# Altium project 8 IR.PrjPcb
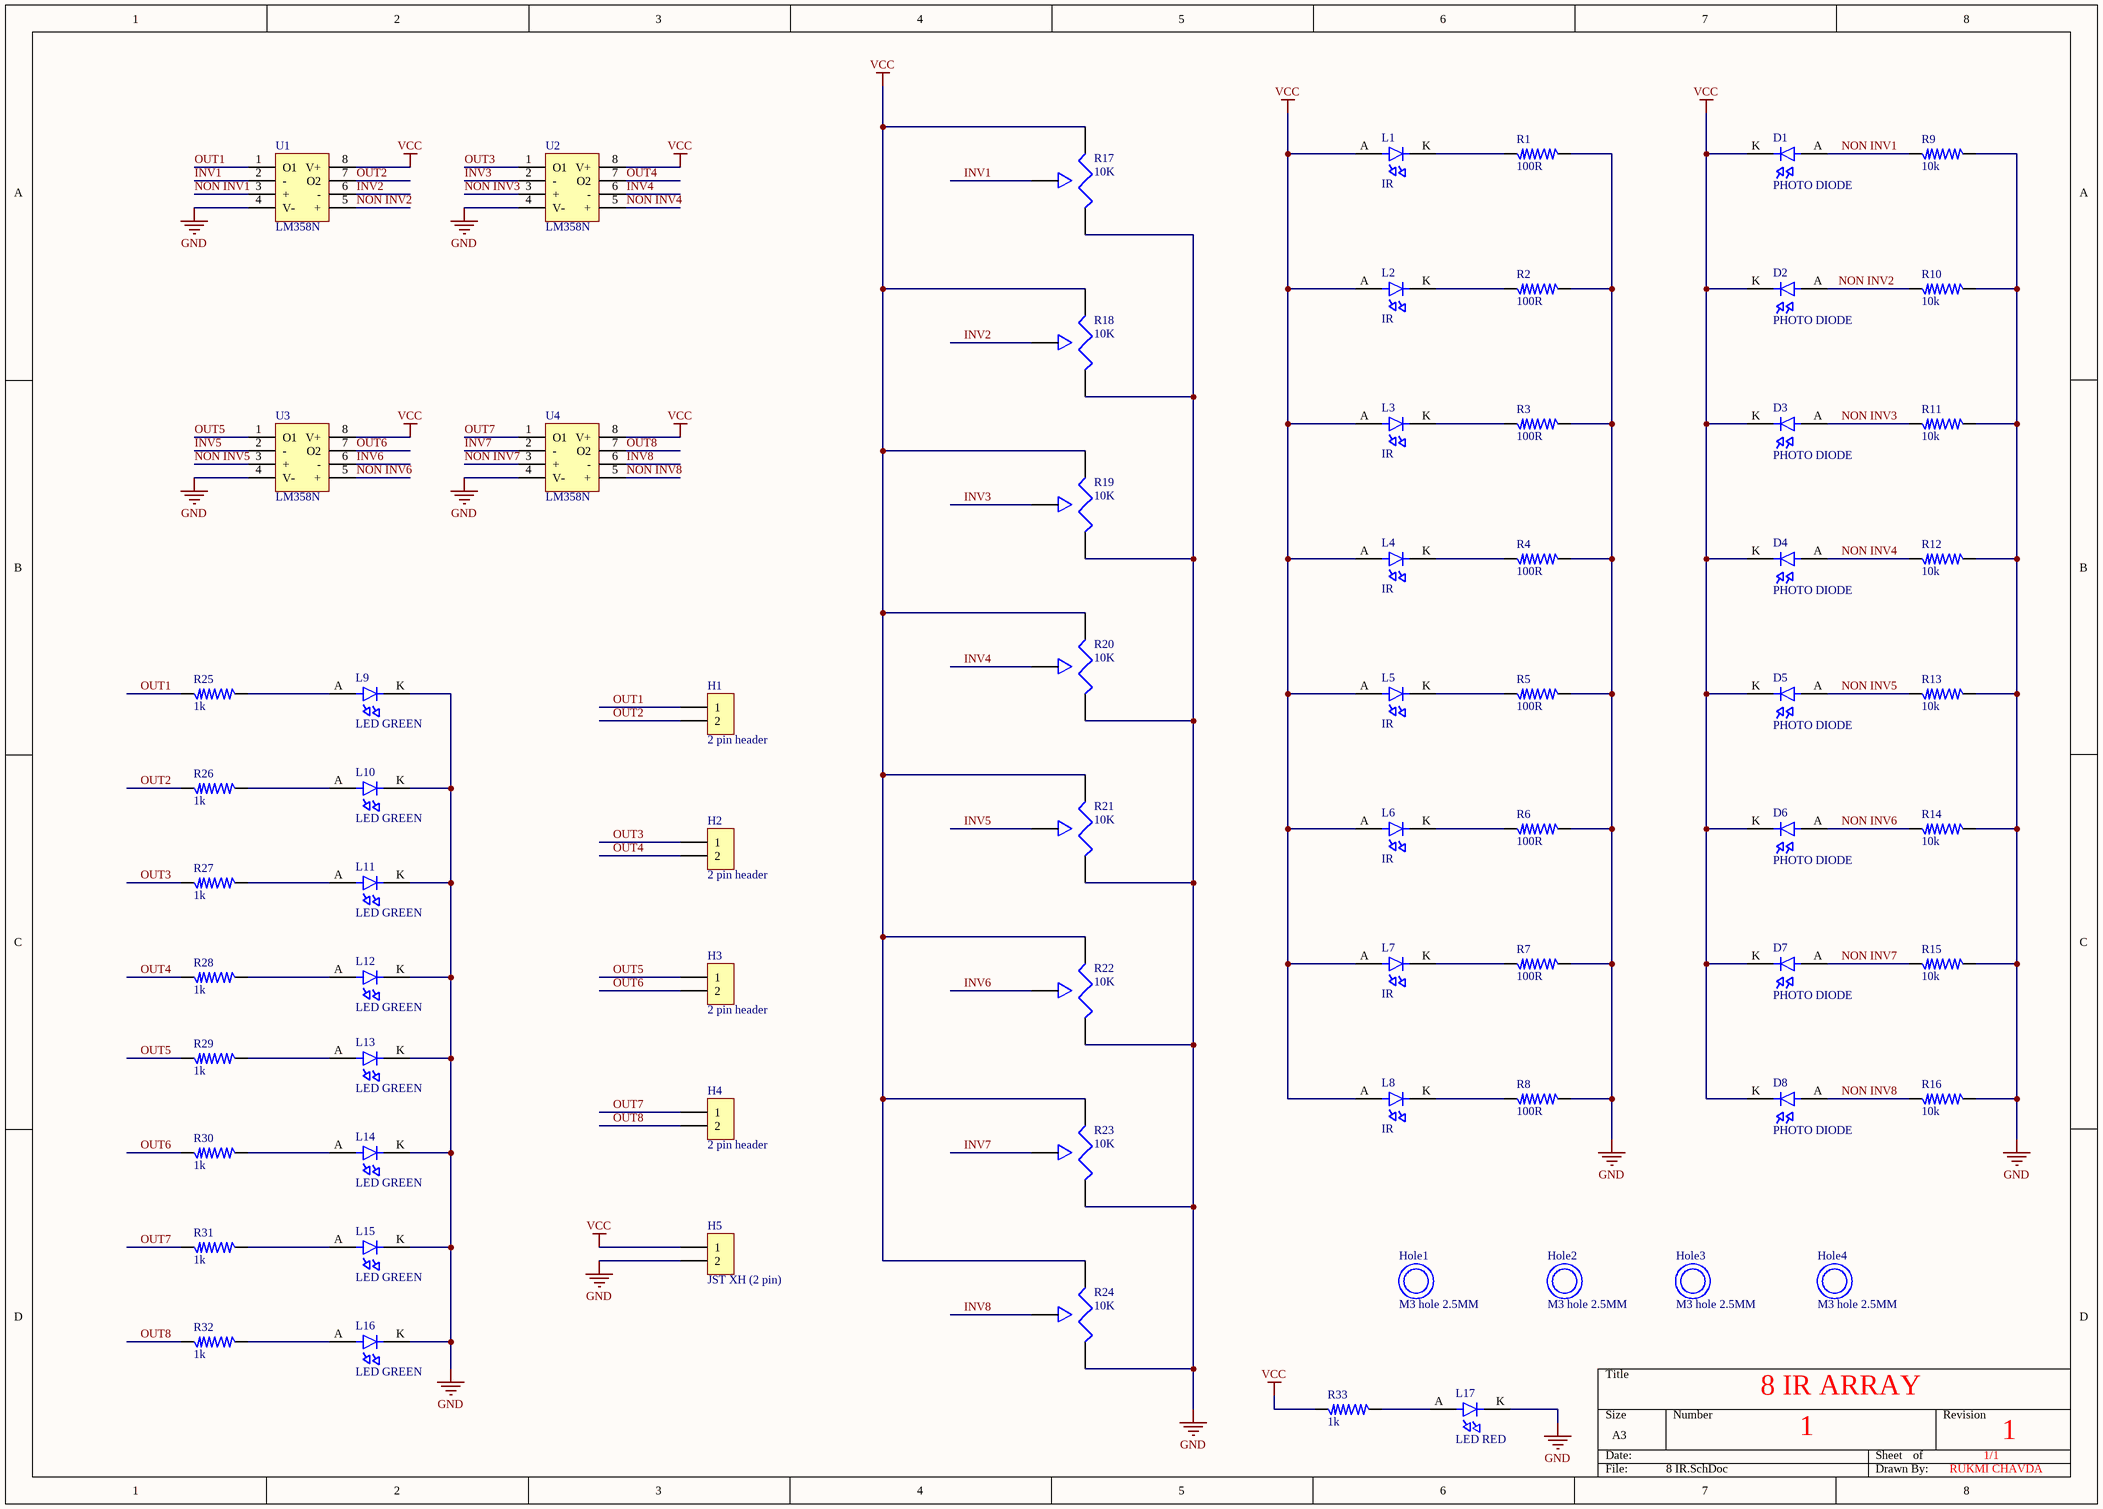
[diagram p0: 8 IR.SchDoc]
1 sheet, 71 parts. Net scope: global (net labels, ports and power ports of the same name join across sheets).
Board file: 8 IR.PcbDoc

## Sheet 8 IR.SchDoc
size A3

### Parts
D1  PHOTO DIODE  [PHOYODIODE]
D2  PHOTO DIODE  [PHOYODIODE]
D3  PHOTO DIODE  [PHOYODIODE]
D4  PHOTO DIODE  [PHOYODIODE]
D5  PHOTO DIODE  [PHOYODIODE]
D6  PHOTO DIODE  [PHOYODIODE]
D7  PHOTO DIODE  [PHOYODIODE]
D8  PHOTO DIODE  [PHOYODIODE]
H1  2 pin header  [header 2]
H2  2 pin header  [header 2]
H3  2 pin header  [header 2]
H4  2 pin header  [header 2]
H5  JST XH (2 pin)  [jst 2 pin XH]
Hole1  M3 hole 2.5MM  [M3 Hole]  (no BOM)
Hole2  M3 hole 2.5MM  [M3 Hole]  (no BOM)
Hole3  M3 hole 2.5MM  [M3 Hole]  (no BOM)
Hole4  M3 hole 2.5MM  [M3 Hole]  (no BOM)
L1  IR  [LED IR]
L2  IR  [LED IR]
L3  IR  [LED IR]
L4  IR  [LED IR]
L5  IR  [LED IR]
L6  IR  [LED IR]
L7  IR  [LED IR]
L8  IR  [LED IR]
L9  LED GREEN  [LED GREEN]
L10  LED GREEN  [LED GREEN]
L11  LED GREEN  [LED GREEN]
L12  LED GREEN  [LED GREEN]
L13  LED GREEN  [LED GREEN]
L14  LED GREEN  [LED GREEN]
L15  LED GREEN  [LED GREEN]
L16  LED GREEN  [LED GREEN]
L17  LED RED  [LED RED]
R1  100R  [100R]
R2  100R  [100R]
R3  100R  [100R]
R4  100R  [100R]
R5  100R  [100R]
R6  100R  [100R]
R7  100R  [100R]
R8  100R  [100R]
R9  10k  [10k]
R10  10k  [10k]
R11  10k  [10k]
R12  10k  [10k]
R13  10k  [10k]
R14  10k  [10k]
R15  10k  [10k]
R16  10k  [10k]
R17  10K  [trimer pot]
R18  10K  [trimer pot]
R19  10K  [trimer pot]
R20  10K  [trimer pot]
R21  10K  [trimer pot]
R22  10K  [trimer pot]
R23  10K  [trimer pot]
R24  10K  [trimer pot]
R25  1k  [1k]
R26  1k  [1k]
R27  1k  [1k]
R28  1k  [1k]
R29  1k  [1k]
R30  1k  [1k]
R31  1k  [1k]
R32  1k  [1k]
R33  1k  [1k]
U1  LM358N  [LM 358 DIP]
U2  LM358N  [LM 358 DIP]
U3  LM358N  [LM 358 DIP]
U4  LM358N  [LM 358 DIP]

### Nets
GND: H5.2 L9.K L10.K L11.K L12.K L13.K L14.K L15.K L16.K L17.K R1.2 R2.2 R3.2 R4.2 R5.2 R6.2 R7.2 R8.2 R9.2 R10.2 R11.2 R12.2 R13.2 R14.2 R15.2 R16.2 R17.1 R18.1 R19.1 R20.1 R21.1 R22.1 R23.1 R24.1 U1.4(V-) U2.4(V-) U3.4(V-) U4.4(V-)
VCC: D1.K D2.K D3.K D4.K D5.K D6.K D7.K D8.K H5.1 L1.A L2.A L3.A L4.A L5.A L6.A L7.A L8.A R17.2 R18.2 R19.2 R20.2 R21.2 R22.2 R23.2 R24.2 R33.1 U1.8(V+) U2.8(V+) U3.8(V+) U4.8(V+)
INV1: R17.3 U1.2(-)
INV2: R18.3 U1.6(-)
INV3: R19.3 U2.2(-)
INV4: R20.3 U2.6(-)
INV5: R21.3 U3.2(-)
INV6: R22.3 U3.6(-)
INV7: R23.3 U4.2(-)
INV8: R24.3 U4.6(-)
NON INV1: D1.A R9.1 U1.3(+)
NON INV2: D2.A R10.1 U1.5(+)
NON INV3: D3.A R11.1 U2.3(+)
NON INV4: D4.A R12.1 U2.5(+)
NON INV5: D5.A R13.1 U3.3(+)
NON INV6: D6.A R14.1 U3.5(+)
NON INV7: D7.A R15.1 U4.3(+)
NON INV8: D8.A R16.1 U4.5(+)
OUT1: H1.1 R25.1 U1.1(O1)
OUT2: H1.2 R26.1 U1.7(O2)
OUT3: H2.1 R27.1 U2.1(O1)
OUT4: H2.2 R28.1 U2.7(O2)
OUT5: H3.1 R29.1 U3.1(O1)
OUT6: H3.2 R30.1 U3.7(O2)
OUT7: H4.1 R31.1 U4.1(O1)
OUT8: H4.2 R32.1 U4.7(O2)
NetL1_K: L1.K R1.1
NetL2_K: L2.K R2.1
NetL3_K: L3.K R3.1
NetL4_K: L4.K R4.1
NetL5_K: L5.K R5.1
NetL6_K: L6.K R6.1
NetL7_K: L7.K R7.1
NetL8_K: L8.K R8.1
NetL9_A: L9.A R25.2
NetL10_A: L10.A R26.2
NetL11_A: L11.A R27.2
NetL12_A: L12.A R28.2
NetL13_A: L13.A R29.2
NetL14_A: L14.A R30.2
NetL15_A: L15.A R31.2
NetL16_A: L16.A R32.2
NetL17_A: L17.A R33.2

### Notes on the sheet
- 8 IR ARRAY
- 1
- 1/1
- RUKMI CHAVDA

### Library data of the parts
D1-D8 = PHOTO DIODE: VISHAY         BPW24R             PHOTODIODE, 11PF; Manufacturer 1: Vishay Semiconductors; Max Reverse Voltage (DC): 60V; Fall Time: 7ns; Max Power Dissipation: 210mW; Diode Type: PIN; Dark Current: 2nA; Wavelength: 900nm; Viewing Angle: 24°; Breakdown Voltage: 200V; Supplier 1: Digi-Key; Manufacturer Part Number 1: BPW24R; RoHS: Yes; Category: Photodiodes; Stock 1: 330; Pricing 1: 1=4.50000, 10=3.75000, 100=2.62500, 500=2.17500, 1000=1.99500, 2500=1.91250, 5000=1.87500, 10000=1.83750, 25000=1.83000 (USD); Mount: Through Hole,PCB; Case/Package: TO-18; Number of Pins: 2; Min Operating Temperature: -40°C; Max Operating Temperature: 125°C; Packaging: Bulk; Package Quantity: 1000; Reverse Voltage (DC): 60V; Power Dissipation: 210mW; Rise Time: 7ns; Reverse Breakdown Voltage: 60V; Length: 5.5mm; Height: 6.15mm; Width: 5.5mm; Radiation Hardening: No; REACH SVHC: Unknown; Lead Free: Lead Free; ComponentLink1URL: https://datasheet.ciiva.com/1249/bpw24r-1249072.pdf?src-supplier=Element14; ComponentLink1Description: https://datasheet.ciiva.com/1249/bpw24r-1249072.pdf?src-supplier=Element14; ComponentLink2URL: https://datasheet.ciiva.com/25620/0900766b80e22c13-25620417.pdf?src-supplier=RSComponents; ComponentLink2Description: https://datasheet.ciiva.com/25620/0900766b80e22c13-25620417.pdf?src-supplier=RSComponents; ComponentLink3URL: https://datasheet.ciiva.com/12069/bpw24r-84710-12069380.pdf?src-supplier=Mouser; ComponentLink3Description: https://datasheet.ciiva.com/12069/bpw24r-84710-12069380.pdf?src-supplier=Mouser; ComponentLink4URL: https://datasheet.ciiva.com/15117/getdatasheetpartid-513681-15117156.pdf?src-supplier=Verical; ComponentLink4Description: https://datasheet.ciiva.com/15117/getdatasheetpartid-513681-15117156.pdf?src-supplier=Verical; ComponentLink5URL: https://datasheet.ciiva.com/4269/bpw24r-4269996.pdf?src-supplier=Arrow+Electronics; ComponentLink5Description: https://datasheet.ciiva.com/4269/bpw24r-4269996.pdf?src-supplier=Arrow+Electronics; ComponentLink6URL: https://datasheet.ciiva.com/2819/bpw24r-2819745.pdf?src-supplier=Digi-Key; ComponentLink6Description: https://datasheet.ciiva.com/2819/bpw24r-2819745.pdf?src-supplier=Digi-Key; ComponentLink7URL: https://datasheet.ciiva.com/14098/bpw24r-eng-tds-14098567.pdf?src-supplier=Distrelec; ComponentLink7Description: https://datasheet.ciiva.com/14098/bpw24r-eng-tds-14098567.pdf?src-supplier=Distrelec; ComponentLink8URL: https://datasheet.ciiva.com/16349/bpw24r-16349740.pdf?src-supplier=Future+Electronics; ComponentLink8Description: https://datasheet.ciiva.com/16349/bpw24r-16349740.pdf?src-supplier=Future+Electronics; Supplier Part Number 1: 751-1014-ND
H1-H4 = 2 pin header: connector
H5 = JST XH (2 pin): Conn Shrouded Header (4 Sides) HDR 2 POS 2.5mm Solder ST Thru-Hole Box; Manufacturer Part Number: B2B-XH-A(LF)(SN); Number of Positions: 2; Connector Type: Male Pin; Contact Resistance: 20mR; Max Current Rating: 3A; Max Voltage Rating (AC): 250V; Insulation Resistance: 1GR; Wire/Cable Gauge: 22AWG; Supplier 1: Newark; Manufacturer: JST; RoHS: Yes; Category: FFC / FPC; Stock 1: 263047; Pricing 1: 1=0.26000, 10=0.22300, 100=0.19700, 500=0.17500, 1000=0.17100, 5000=0.15500, 10000=0.14500 (USD); Mount: Through Hole; Contact Plating: Tin,Copper,Lead; Color: Natural; Contact Material: Brass; Housing Color: White; Housing Material: Polyamide; Min Operating Temperature: -25°C; Max Operating Temperature: 85°C; Number of Rows: 1; Packaging: Bulk; Termination: Solder; Fastening Type: Detent; Orientation: Straight; Current Rating: 3A; Voltage Rating: 250V; Voltage Rating (AC): 250V; Number of Contacts: 2; Max Voltage Rating (DC): 250V; Length: 7.4mm; Pitch: 2.5mm; Depth: 5.75mm; Lead Pitch: 2.5mm; Lead Free: Lead Free; REACH SVHC: No SVHC; ComponentLink1URL: https://datasheet.ciiva.com/26894/getdatasheetpartid-640357-26894434.pdf?src-supplier=Verical; ComponentLink1Description: https://datasheet.ciiva.com/26894/getdatasheetpartid-640357-26894434.pdf?src-supplier=Verical; ComponentLink2URL: https://datasheet.ciiva.com/11746/0900766b8082653e-11746979.pdf?src-supplier=RSComponents; ComponentLink2Description: https://datasheet.ciiva.com/11746/0900766b8082653e-11746979.pdf?src-supplier=RSComponents; ComponentLink3URL: https://datasheet.ciiva.com/26894/getdatasheetpartid-385291-26894760.pdf?src-supplier=Verical; ComponentLink3Description: https://datasheet.ciiva.com/26894/getdatasheetpartid-385291-26894760.pdf?src-supplier=Verical; ComponentLink4URL: https://datasheet.ciiva.com/8052/5448-8052024.pdf?src-supplier=Element14; ComponentLink4Description: https://datasheet.ciiva.com/8052/5448-8052024.pdf?src-supplier=Element14; ComponentLink5URL: https://datasheet.ciiva.com/20207/523653-20207167.pdf?src-supplier=Rapid+Electronics; ComponentLink5Description: https://datasheet.ciiva.com/20207/523653-20207167.pdf?src-supplier=Rapid+Electronics; Supplier Part Number 1: 73M9415
Hole1-Hole4 = M3 hole 2.5MM: Mounting hole
L1-L8 = IR: EMITTER IR 940NM 100MA RADIAL; Manufacturer 1: Everlight; Manufacturer Part Number 1: IR333-A; Test Current: 20mA; Forward Voltage: 1.2V; Viewing Angle: 20°; Lens Style: Diffused,Colored,Circular; Number of Elements: 1; Forward Current: 50mA; Max Power Dissipation: 100mW; Reverse Voltage: 5V; Supplier 1: Digi-Key; RoHS: Yes; Category: LEDs; Stock 1: 103626; Pricing 1: 1=0.44000, 10=0.31500, 100=0.14000, 500=0.09800, 1000=0.08050, 2500=0.07000, 5000=0.06300, 10000=0.05600, 25000=0.05250 (USD); Mount: Through Hole; Case/Package: Radial; Number of Pins: 2; Min Operating Temperature: -40°C; Max Operating Temperature: 85°C; Packaging: Bulk; Package Quantity: 500; Orientation: Top View; Wavelength: 940nm; Power Dissipation: 100mW; Number of LEDs: 1; Length: 5.9mm; Depth: 5.9mm; Lead Free: Lead Free; ComponentLink1URL: https://datasheet.ciiva.com/48438/ir333-a-eng-tds-48438869.pdf?src-supplier=Distrelec; ComponentLink1Description: https://datasheet.ciiva.com/48438/ir333-a-eng-tds-48438869.pdf?src-supplier=Distrelec; ComponentLink2URL: https://datasheet.ciiva.com/2107/201407061516067600-2107736.pdf?src-supplier=Digi-Key; ComponentLink2Description: https://datasheet.ciiva.com/2107/201407061516067600-2107736.pdf?src-supplier=Digi-Key; Supplier Part Number 1: 1080-1080-ND
L9-L16 = LED GREEN: LED GREEN DIFFUSED T-1 3/4 T/H; Manufacturer 1: Vishay Lite-On; Reverse Voltage: 5V; Test Current: 10mA; Dominant Wavelength: 573nm; Number of Elements: 1; Power Dissipation: 100mW; Capacitance: 35pF; Lens Style: Dome,Diffused,Colored,Circular; Viewing Angle: 36°; Luminous Intensity: 19mcd; Forward Current: 30mA; Forward Voltage: 2.1V; Wavelength: 569nm; Supplier 1: Digi-Key; Manufacturer Part Number 1: LTL-4233; RoHS: Yes; Category: LEDs; Stock 1: 87589; Pricing 1: 1=0.36000, 10=0.26200, 100=0.12420, 500=0.08280, 1000=0.06486, 2500=0.06348, 5000=0.05520, 10000=0.04968, 25000=0.04416 (USD); Mount: Through Hole; Case/Package: Radial; Number of Pins: 2; Color: Green; Lens Color: Green; Min Operating Temperature: -55°C; Max Operating Temperature: 100°C; Packaging: Bulk; Package Quantity: 1000; Lens Transparency: Diffused; Number of LEDs: 1; Illumination Color: Green; Max Power Dissipation: 100mW; Diameter: 5mm; Length: 5.6mm; Height: 8.6mm; Depth: 5.6mm; Width: 5.6mm; Radiation Hardening: No; Lead Free: Lead Free; ComponentLink1URL: https://datasheet.ciiva.com/2112/ltl-4233-2112286.pdf?src-supplier=Digi-Key; ComponentLink1Description: https://datasheet.ciiva.com/2112/ltl-4233-2112286.pdf?src-supplier=Digi-Key; ComponentLink2URL: https://datasheet.ciiva.com/15117/getdatasheetpartid-116706-15117565.pdf?src-supplier=Verical; ComponentLink2Description: https://datasheet.ciiva.com/15117/getdatasheetpartid-116706-15117565.pdf?src-supplier=Verical; ComponentLink3URL: https://datasheet.ciiva.com/30255/s-110-ltl-4233-30255321.pdf?src-supplier=Onlinecomponents.com; ComponentLink3Description: https://datasheet.ciiva.com/30255/s-110-ltl-4233-30255321.pdf?src-supplier=Onlinecomponents.com; Supplier Part Number 1: 160-1130-ND
L17 = LED RED: LED RED CLEAR 5MM OVAL T/H; Manufacturer 1: Cree; Manufacturer Part Number 1: C5SMF-RJF-CT0W0BB1; Test Current: 20mA; Dominant Wavelength: 621nm; Forward Voltage: 2.1V; Luminous Intensity: 2640mcd; Lens Style: Elliptical; Viewing Angle: 40°; Supplier 1: Digi-Key; RoHS: Yes; Category: LEDs; Stock 1: 17201; Pricing 1: 1=0.14000, 10=0.13200, 100=0.12160, 1000=0.10877, 50000=0.10100 (USD); Mount: Through Hole; Case/Package: Radial; Color: Red; Lens Color: Red; Min Operating Temperature: -40°C; Max Operating Temperature: 95°C; Illumination Color: Red; Forward Current: 20mA; Package Quantity: 500; Packaging: Bulk; Lens Transparency: Clear; Height: 10.95mm; ComponentLink1URL: https://datasheet.ciiva.com/29562/c5smfrjfrjegjfgjebjfbje1240-29562716.pdf?src-supplier=Digi-Key; ComponentLink1Description: https://datasheet.ciiva.com/29562/c5smfrjfrjegjfgjebjfbje1240-29562716.pdf?src-supplier=Digi-Key; Supplier Part Number 1: C5SMF-RJF-CT0W0BB1-ND
R1-R8 = 100R: RES 100 OHM 1/4W 5% AXIAL; Manufacturer 1: Stackpole Electronics; Manufacturer Part Number 1: CF14JT100R; Temperature Coefficient: -400ppm/°C; Max Power Dissipation: 250mW; Supplier 1: Digi-Key; RoHS: Yes; Category: Through-Hole Resistors; Stock 1: 277395; Pricing 1: 1=0.10000, 10=0.04000, 25=0.02880, 50=0.02200, 100=0.01620, 250=0.01236, 500=0.00990, 1000=0.00729 (USD); Mount: Through Hole,Axial; Case/Package: Conformal; Contact Plating: Tin,Matte; Min Operating Temperature: -55°C; Max Operating Temperature: 155°C; Composition: Carbon Film; Number of Terminations: 2; Military Standard: Not; Termination: Axial; Package Quantity: 1; Resistance: 100R; Power Rating: 250mW; Tolerance: 5%; Packaging: Tape and Reel; Features: Flame Retardant Coating; Diameter: 2.3mm; Length: 6.5mm; Radiation Hardening: No; Lead Free: Lead Free; ComponentLink1URL: http://components.arrow.com/part/dataview/50573446S9848635N1174?src-supplier=Arrow; ComponentLink1Description: http://components.arrow.com/part/dataview/50573446S9848635N1174?src-supplier=Arrow; ComponentLink2URL: https://www.seielect.com/catalog/SEI-Packaging.pdf?src-supplier=Digi-Key; ComponentLink2Description: https://www.seielect.com/catalog/SEI-Packaging.pdf?src-supplier=Digi-Key; ComponentLink3URL: https://www.seielect.com/Catalog/SEI-CF_CFM.pdf?src-supplier=Digi-Key; ComponentLink3Description: https://www.seielect.com/Catalog/SEI-CF_CFM.pdf?src-supplier=Digi-Key; ComponentLink4URL: https://www.verical.com/server-webapp/html/getDatasheet?partID=360125&src-supplier=Verical; ComponentLink4Description: https://www.verical.com/server-webapp/html/getDatasheet?partID=360125&src-supplier=Verical; ComponentLink5URL: https://www.seielect.com/catalog/SEI-CF_CFM.pdf?src-supplier=Avnet; ComponentLink5Description: https://www.seielect.com/catalog/SEI-CF_CFM.pdf?src-supplier=Avnet; ComponentLink6URL: http://www.seielect.com/Catalog/SEI-CF_CFM.pdf?src-supplier=Future+Electronics; ComponentLink6Description: http://www.seielect.com/Catalog/SEI-CF_CFM.pdf?src-supplier=Future+Electronics; Supplier Part Number 1: CF14JT100RCT-ND
R9-R16 = 10k: RES 10K OHM 1/4W 5% AXIAL; Manufacturer 1: Stackpole Electronics; Manufacturer Part Number 1: CF14JT10K0; Temperature Coefficient: -500ppm/°C; Max Power Dissipation: 250mW; Resistance: 10kR; Supplier 1: Digi-Key; RoHS: Yes; Category: Through-Hole Resistors; Stock 1: 746193; Pricing 1: 1=0.10000, 10=0.04000, 25=0.02880, 50=0.02200, 100=0.01620, 250=0.01236, 500=0.00990, 1000=0.00729 (USD); Mount: Through Hole,Axial; Case/Package: Conformal; Contact Plating: Tin,Matte; Min Operating Temperature: -55°C; Max Operating Temperature: 155°C; Number of Terminations: 2; Military Standard: Not; Termination: Axial; Features: Flame Retardant Coating; Packaging: Tape and Reel; Tolerance: 5%; Power Rating: 250mW; Package Quantity: 1; Composition: Carbon Film; Diameter: 2.3mm; Length: 6.5mm; Radiation Hardening: No; Lead Free: Lead Free; ComponentLink1URL: https://www.verical.com/server-webapp/html/getDatasheet?partID=367360&src-supplier=Verical; ComponentLink1Description: https://www.verical.com/server-webapp/html/getDatasheet?partID=367360&src-supplier=Verical; ComponentLink2URL: https://www.seielect.com/catalog/SEI-CF_CFM.pdf?src-supplier=Avnet; ComponentLink2Description: https://www.seielect.com/catalog/SEI-CF_CFM.pdf?src-supplier=Avnet; ComponentLink3URL: http://www.seielect.com/Catalog/SEI-CF_CFM.pdf?src-supplier=Future+Electronics; ComponentLink3Description: http://www.seielect.com/Catalog/SEI-CF_CFM.pdf?src-supplier=Future+Electronics; ComponentLink4URL: https://www.seielect.com/catalog/SEI-Packaging.pdf?src-supplier=Digi-Key; ComponentLink4Description: https://www.seielect.com/catalog/SEI-Packaging.pdf?src-supplier=Digi-Key; ComponentLink5URL: http://components.arrow.com/part/dataview/27619991S9848636N1174?src-supplier=Arrow; ComponentLink5Description: http://components.arrow.com/part/dataview/27619991S9848636N1174?src-supplier=Arrow; Supplier Part Number 1: CF14JT10K0CT-ND
R17-R24 = potentiometer 1: Trimmer pot comman for all
R25-R33 = 1k: Res Carbon Film 1K Ohm 5% 0.25W(1/4W) -400ppm/? to 0ppm/? Conformal Coated AXL T/R; Manufacturer 1: Stackpole Electronics; Manufacturer Part Number 1: CF14JT1K00; Max Power Dissipation: 250mW; Temperature Coefficient: -400ppm/°C; Resistance: 1kR; Supplier 1: Digi-Key; RoHS: Yes; Category: Through-Hole Resistors; Stock 1: 806014; Pricing 1: 1=0.10000, 10=0.04000, 25=0.02880, 50=0.02200, 100=0.01620, 250=0.01236, 500=0.00990, 1000=0.00729 (USD); Mount: Through Hole,Axial; Case/Package: Conformal; Contact Plating: Tin,Matte; Min Operating Temperature: -55°C; Max Operating Temperature: 155°C; Features: Flame Retardant Coating; Composition: Carbon Film; Number of Terminations: 2; Termination: Axial; Military Standard: Not; Packaging: Tape and Reel; Package Quantity: 1; Power Rating: 250mW; Diameter: 2.3mm; Length: 6.5mm; Radiation Hardening: No; Lead Free: Lead Free; ComponentLink1URL: http://www.seielect.com/Catalog/SEI-CF_CFM.pdf?src-supplier=Future+Electronics; ComponentLink1Description: http://www.seielect.com/Catalog/SEI-CF_CFM.pdf?src-supplier=Future+Electronics; ComponentLink2URL: https://www.seielect.com/catalog/SEI-CF_CFM.pdf?src-supplier=Avnet; ComponentLink2Description: https://www.seielect.com/catalog/SEI-CF_CFM.pdf?src-supplier=Avnet; ComponentLink3URL: https://www.seielect.com/catalog/SEI-Packaging.pdf?src-supplier=Digi-Key; ComponentLink3Description: https://www.seielect.com/catalog/SEI-Packaging.pdf?src-supplier=Digi-Key; ComponentLink4URL: https://www.seielect.com/Catalog/SEI-CF_CFM.pdf?src-supplier=Digi-Key; ComponentLink4Description: https://www.seielect.com/Catalog/SEI-CF_CFM.pdf?src-supplier=Digi-Key; ComponentLink5URL: http://components.arrow.com/part/dataview/27620077S9848643N1174?src-supplier=Arrow; ComponentLink5Description: http://components.arrow.com/part/dataview/27620077S9848643N1174?src-supplier=Arrow; ComponentLink6URL: https://www.verical.com/server-webapp/html/getDatasheet?partID=360403&src-supplier=Verical; ComponentLink6Description: https://www.verical.com/server-webapp/html/getDatasheet?partID=360403&src-supplier=Verical; Supplier Part Number 1: CF14JT1K00CT-ND; Tolerance: 5%
U1-U4 = LM358N: TEXAS INSTRUMENTS - LM358N/NOPB - OP AMP DUAL; Unity Gain Bandwidth Product: 1MHz; Slew Rate: 0.1V/µs; Common Mode Rejection Ratio: 65dB; Max Supply Voltage: 32V; Min Supply Voltage: 3V; Min Dual Supply Voltage: 1.5V; Max Dual Supply Voltage: 16V; Nominal Supply Current: 1mA; Operating Supply Voltage: 5V; Max Power Dissipation: 830mW; Voltage Gain: 100dB; Number of Channels: 2; Input Bias Current: 45nA; Input Offset Voltage (Vos): 2mV; Max Supply Current: 1.2mA; Output Current per Channel: 40mA; Output Current: 20mA; Supplier 1: Digi-Key; Manufacturer 1: Texas Instruments; Manufacturer Part Number 1: LM358N/NOPB; RoHS: Yes; Category: Amplifiers - Op Amps, Buffer, Instrumentation; Stock 1: 26579; Pricing 1: 1=0.87000, 10=0.77900, 25=0.73920, 100=0.56760, 250=0.50160, 500=0.47520, 1000=0.36960, 2500=0.35112, 5000=0.33792 (USD); Mount: Through Hole; Case/Package: DIP; Number of Pins: 8; Contact Plating: Tin,Matte; Min Operating Temperature: 0°C; Max Operating Temperature: 70°C; Packaging: Rail/Tube; Bandwidth: 1MHz; Number of Elements: 2; Power Dissipation: 830mW; Power Supply Rejection Ratio (PSRR): 65dB; Gain Bandwidth Product: 1MHz; Number of Amplifiers: 2; Number of Circuits: 2; Length: 9.27mm; Height: 3.3mm; Width: 6.35mm; REACH SVHC: No SVHC; Lead Free: Lead Free; ComponentLink1URL: https://datasheet.ciiva.com/49046/1902748-49046503.pdf?src-supplier=Element14; ComponentLink1Description: https://datasheet.ciiva.com/49046/1902748-49046503.pdf?src-supplier=Element14; Supplier Part Number 1: LM358NNS/NOPB-ND